# Altium schematic sheet TempA3.SchDoc
size A3; SheetNumber: 1; SheetTotal: 1
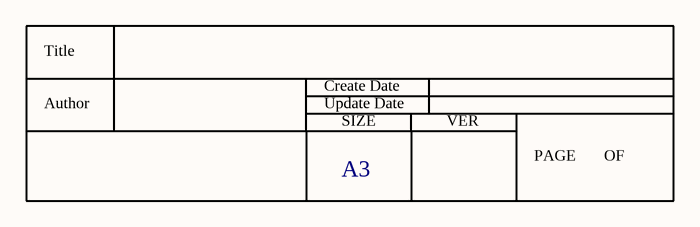
[diagram p0: TempA3.SchDoc]

## Notes on the sheet
- Title
- Create Date
- Author
- Update Date
- SIZE
- A3
- VER
- PAGE
- OF